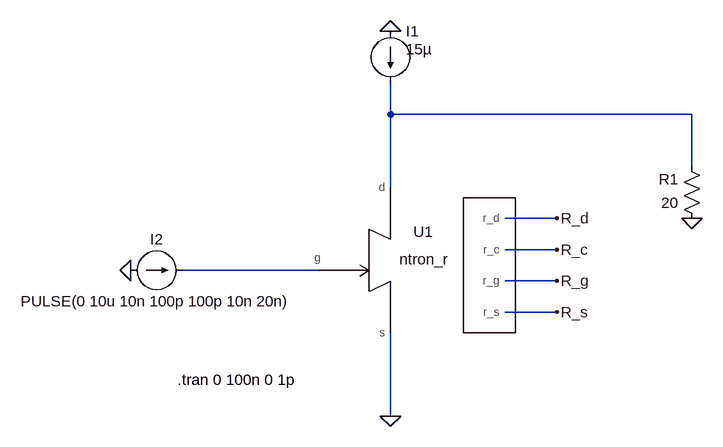
[diagram p0: schematic test_ntron_r.asc]
test_ntron_r.asc, the LTspice schematic file:
Version 4
SHEET 1 1304 680
WIRE 336 -48 336 -96
WIRE 800 -48 336 -48
WIRE 800 32 800 -48
WIRE 336 64 336 -48
WIRE 592 112 512 112
WIRE 592 160 512 160
WIRE 224 192 16 192
WIRE 592 208 512 208
WIRE 592 256 512 256
WIRE 336 416 336 288
FLAG 336 416 0
FLAG 336 -176 0
FLAG -64 192 0
FLAG 800 112 0
FLAG 592 112 R_d
FLAG 592 160 R_c
FLAG 592 208 R_g
FLAG 592 256 R_s
SYMBOL current 336 -176 R0
WINDOW 3 24 28 Left 2
WINDOW 123 0 0 Left 0
WINDOW 39 0 0 Left 0
SYMATTR Value 15µ
SYMATTR InstName I1
SYMBOL current -64 192 R270
WINDOW 0 32 40 VTop 2
WINDOW 3 -32 40 VBottom 2
WINDOW 123 0 0 Left 0
WINDOW 39 0 0 Left 0
SYMATTR InstName I2
SYMATTR Value PULSE(0 10u 10n 100p 100p 10n 20n)
SYMBOL res 816 128 R180
WINDOW 0 36 76 Left 2
WINDOW 3 36 40 Left 2
SYMATTR InstName R1
SYMATTR Value 20
SYMBOL ntron_r 336 176 R0
WINDOW 39 2 131 Invisible 2
SYMATTR InstName U1
TEXT 8 360 Left 2 !.tran 0 100n 0 1p

The netlist it stands for:
* test_ntron_r.asc
I1 0 N001 15µ
I2 0 N002 PULSE(0 10u 10n 100p 100p 10n 20n)
R1 0 N001 20
XU1 N002 N001 0 R_g R_d R_c R_s ntron_r ntron_r width_g=12n width_s=200n width_d=200n width_c=108n sq_g=22 sq_d=200 sq_s=22 sq_c=10 thickness=4n sheetRes=400 Tc=10.5 Tsub=4 Jc=46G C=1 A1=0.4  ; pins g d s r_g r_d r_c r_s
.tran 0 100n 0 1p
.lib ntron_r.lib
.backanno
.end